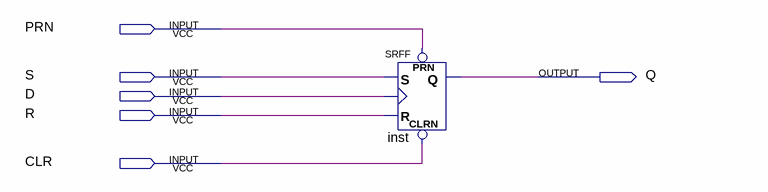
[diagram p0: schematic sheet]
// Quartus schematic SRR-flipflopDiagram.bdf as structural Verilog: 1 symbols, 6 pins
module \SRR-flipflopDiagram  (
  input  PRN,
  input  S,
  input  D,
  input  R,
  input  CLR,
  output Q
);

  SRFF inst (.PRN(PRN), .CLRN(CLR), .S(S), .R(R), .CLK(D), .Q(Q));
endmodule
